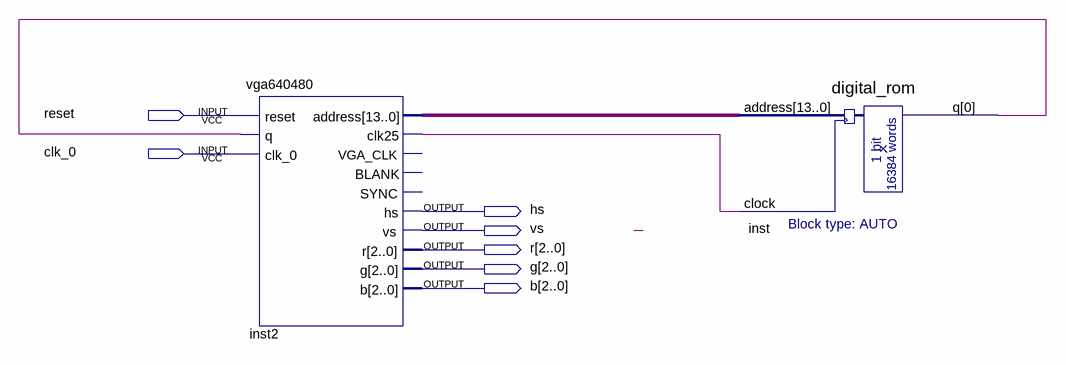
[diagram p0: schematic sheet]
// Quartus schematic vga_rom.bdf as structural Verilog: 2 symbols, 7 pins
module vga_rom (
  input  reset,
  input  clk_0,
  output hs,
  output vs,
  output [2:0] r,
  output [2:0] g,
  output [2:0] b
);

  wire inst2_clk25, inst_q;
  wire [13:0] inst2_address;

  vga640480 inst2 (
    .reset(reset), .q(inst_q), .clk_0(clk_0), .address(inst2_address), .clk25(inst2_clk25), .hs(hs), .vs(vs),
    .r(r), .g(g), .b(b));  // open: VGA_CLK, BLANK, SYNC
  digital_rom inst (.address(inst2_address), .clock(inst2_clk25), .q(inst_q));
endmodule
